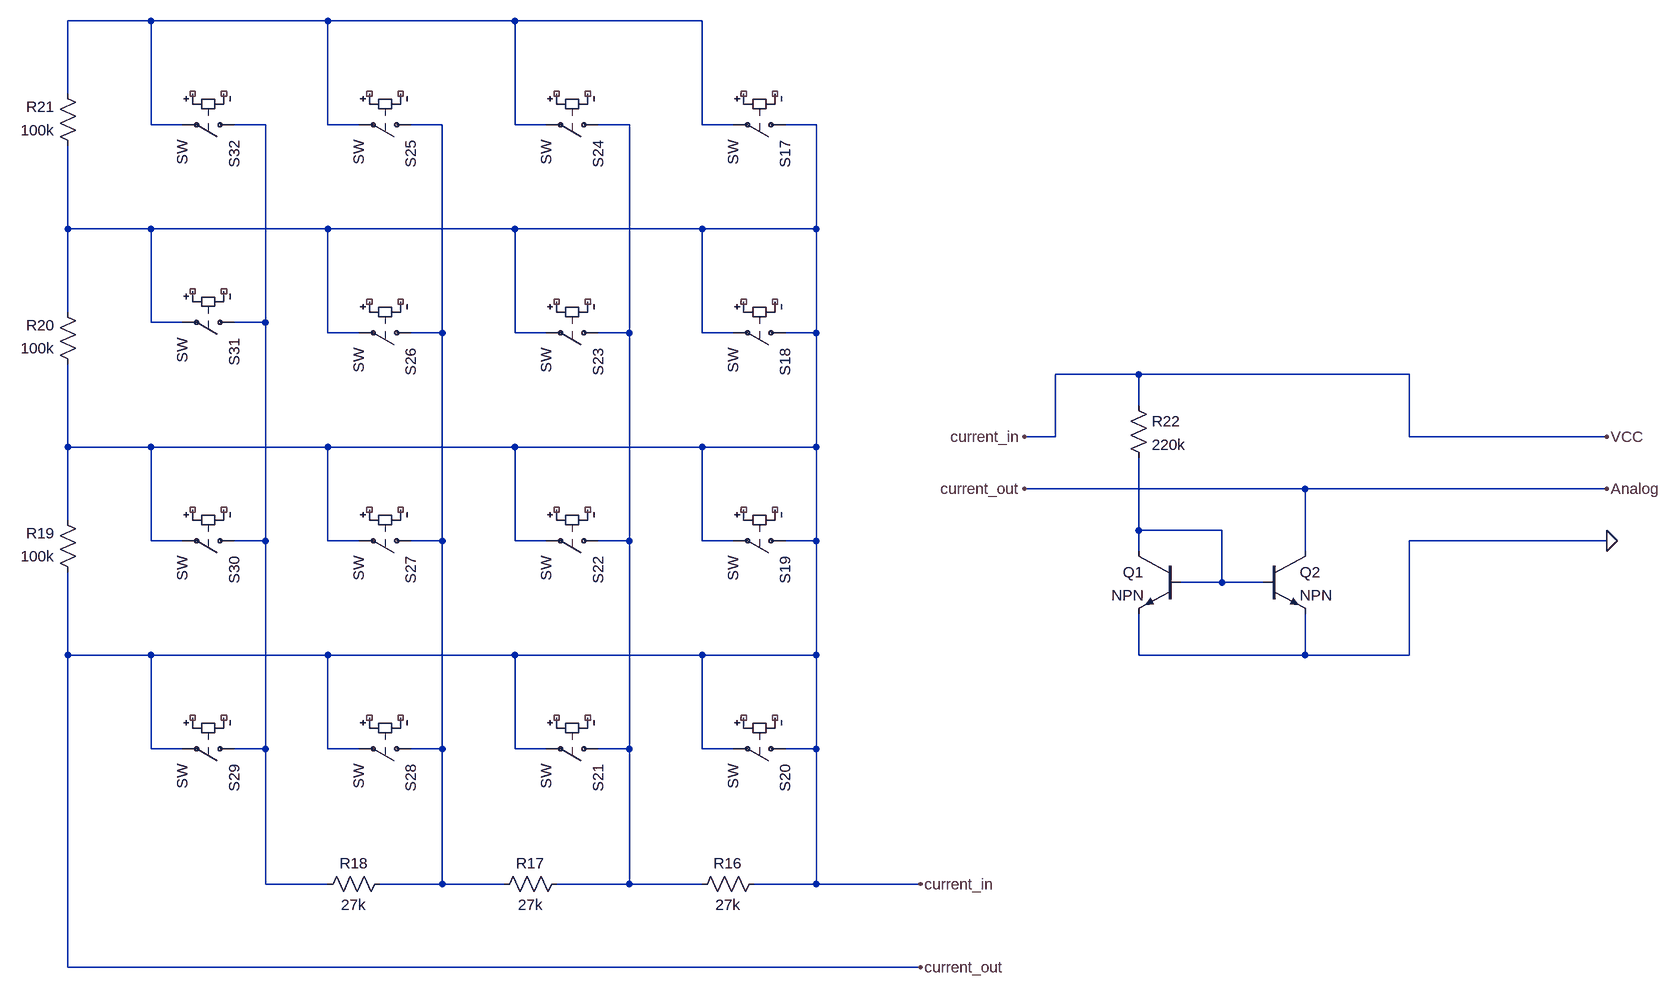
[diagram p0: schematic keypad_io.asc]
keypad_io.asc, the LTspice schematic file:
Version 4
SHEET 1 3556 1060
WIRE 944 -464 816 -464
WIRE 1216 -464 944 -464
WIRE 1504 -464 1216 -464
WIRE 1792 -464 1504 -464
WIRE 816 -352 816 -464
WIRE 944 -304 944 -464
WIRE 992 -304 944 -304
WIRE 1120 -304 1072 -304
WIRE 1216 -304 1216 -464
WIRE 1264 -304 1216 -304
WIRE 1392 -304 1344 -304
WIRE 1504 -304 1504 -464
WIRE 1552 -304 1504 -304
WIRE 1680 -304 1632 -304
WIRE 1792 -304 1792 -464
WIRE 1840 -304 1792 -304
WIRE 1968 -304 1920 -304
WIRE 816 -144 816 -272
WIRE 944 -144 816 -144
WIRE 1216 -144 944 -144
WIRE 1504 -144 1216 -144
WIRE 1792 -144 1504 -144
WIRE 1968 -144 1968 -304
WIRE 1968 -144 1792 -144
WIRE 816 -16 816 -144
WIRE 944 0 944 -144
WIRE 992 0 944 0
WIRE 1120 0 1120 -304
WIRE 1120 0 1072 0
WIRE 1216 16 1216 -144
WIRE 1264 16 1216 16
WIRE 1392 16 1392 -304
WIRE 1392 16 1344 16
WIRE 1504 16 1504 -144
WIRE 1552 16 1504 16
WIRE 1680 16 1680 -304
WIRE 1680 16 1632 16
WIRE 1792 16 1792 -144
WIRE 1840 16 1792 16
WIRE 1968 16 1968 -144
WIRE 1968 16 1920 16
WIRE 2464 80 2336 80
WIRE 2880 80 2464 80
WIRE 2464 128 2464 80
WIRE 2336 176 2336 80
WIRE 2336 176 2288 176
WIRE 2880 176 2880 80
WIRE 3184 176 2880 176
WIRE 816 192 816 64
WIRE 944 192 816 192
WIRE 1216 192 944 192
WIRE 1504 192 1216 192
WIRE 1792 192 1504 192
WIRE 1968 192 1968 16
WIRE 1968 192 1792 192
WIRE 2720 256 2288 256
WIRE 3184 256 2720 256
WIRE 816 304 816 192
WIRE 2464 320 2464 208
WIRE 2592 320 2464 320
WIRE 944 336 944 192
WIRE 992 336 944 336
WIRE 1120 336 1120 0
WIRE 1120 336 1072 336
WIRE 1216 336 1216 192
WIRE 1264 336 1216 336
WIRE 1392 336 1392 16
WIRE 1392 336 1344 336
WIRE 1504 336 1504 192
WIRE 1552 336 1504 336
WIRE 1680 336 1680 16
WIRE 1680 336 1632 336
WIRE 1792 336 1792 192
WIRE 1840 336 1792 336
WIRE 1968 336 1968 192
WIRE 1968 336 1920 336
WIRE 3184 336 2880 336
WIRE 2464 352 2464 320
WIRE 2720 352 2720 256
WIRE 2592 400 2592 320
WIRE 2592 400 2528 400
WIRE 2656 400 2592 400
WIRE 816 512 816 384
WIRE 944 512 816 512
WIRE 1216 512 944 512
WIRE 1504 512 1216 512
WIRE 1792 512 1504 512
WIRE 1968 512 1968 336
WIRE 1968 512 1792 512
WIRE 2464 512 2464 448
WIRE 2720 512 2720 448
WIRE 2720 512 2464 512
WIRE 2880 512 2880 336
WIRE 2880 512 2720 512
WIRE 944 656 944 512
WIRE 992 656 944 656
WIRE 1120 656 1120 336
WIRE 1120 656 1072 656
WIRE 1216 656 1216 512
WIRE 1264 656 1216 656
WIRE 1392 656 1392 336
WIRE 1392 656 1344 656
WIRE 1504 656 1504 512
WIRE 1552 656 1504 656
WIRE 1680 656 1680 336
WIRE 1680 656 1632 656
WIRE 1792 656 1792 512
WIRE 1840 656 1792 656
WIRE 1968 656 1968 512
WIRE 1968 656 1920 656
WIRE 1120 864 1120 656
WIRE 1216 864 1120 864
WIRE 1392 864 1392 656
WIRE 1392 864 1296 864
WIRE 1488 864 1392 864
WIRE 1680 864 1680 656
WIRE 1680 864 1568 864
WIRE 1792 864 1680 864
WIRE 1968 864 1968 656
WIRE 1968 864 1872 864
WIRE 2128 864 1968 864
WIRE 816 992 816 512
WIRE 2128 992 816 992
FLAG 3184 336 0
FLAG 2128 864 current_in
FLAG 2128 992 current_out
FLAG 2288 256 current_out
FLAG 3184 176 VCC
FLAG 3184 256 Analog
FLAG 2288 176 current_in
SYMBOL sw 1936 -304 R90
SYMATTR InstName S17
SYMBOL sw 1936 16 R90
SYMATTR InstName S18
SYMBOL sw 1936 336 R90
SYMATTR InstName S19
SYMBOL sw 1936 656 R90
SYMATTR InstName S20
SYMBOL sw 1648 656 R90
SYMATTR InstName S21
SYMBOL sw 1648 336 R90
SYMATTR InstName S22
SYMBOL sw 1648 16 R90
SYMATTR InstName S23
SYMBOL sw 1648 -304 R90
SYMATTR InstName S24
SYMBOL sw 1360 -304 R90
SYMATTR InstName S25
SYMBOL sw 1360 16 R90
SYMATTR InstName S26
SYMBOL sw 1360 336 R90
SYMATTR InstName S27
SYMBOL sw 1360 656 R90
SYMATTR InstName S28
SYMBOL sw 1088 656 R90
SYMATTR InstName S29
SYMBOL sw 1088 336 R90
SYMATTR InstName S30
SYMBOL sw 1088 0 R90
SYMATTR InstName S31
SYMBOL sw 1088 -304 R90
SYMATTR InstName S32
SYMBOL res 1888 848 R90
WINDOW 0 0 56 VBottom 2
WINDOW 3 32 56 VTop 2
SYMATTR InstName R16
SYMATTR Value 27k
SYMBOL res 1584 848 R90
WINDOW 0 0 56 VBottom 2
WINDOW 3 32 56 VTop 2
SYMATTR InstName R17
SYMATTR Value 27k
SYMBOL res 1312 848 R90
WINDOW 0 0 56 VBottom 2
WINDOW 3 32 56 VTop 2
SYMATTR InstName R18
SYMATTR Value 27k
SYMBOL res 832 400 R180
WINDOW 0 36 76 Left 2
WINDOW 3 36 40 Left 2
SYMATTR InstName R19
SYMATTR Value 100k
SYMBOL res 832 80 R180
WINDOW 0 36 76 Left 2
WINDOW 3 36 40 Left 2
SYMATTR InstName R20
SYMATTR Value 100k
SYMBOL res 832 -256 R180
WINDOW 0 36 76 Left 2
WINDOW 3 36 40 Left 2
SYMATTR InstName R21
SYMATTR Value 100k
SYMBOL res 2448 112 R0
SYMATTR InstName R22
SYMATTR Value 220k
SYMBOL npn 2528 352 M0
SYMATTR InstName Q1
SYMBOL npn 2656 352 R0
SYMATTR InstName Q2

The netlist it stands for:
* keypad_io.asc
S17 Analog N001 NC_01 NC_02 SW
S18 Analog Analog NC_03 NC_04 SW
S19 Analog Analog NC_05 NC_06 SW
S20 Analog Analog NC_07 NC_08 SW
S21 N004 Analog NC_09 NC_10 SW
S22 N004 Analog NC_11 NC_12 SW
S23 N004 Analog NC_13 NC_14 SW
S24 N004 N001 NC_15 NC_16 SW
S25 N003 N001 NC_17 NC_18 SW
S26 N003 Analog NC_19 NC_20 SW
S27 N003 Analog NC_21 NC_22 SW
S28 N003 Analog NC_23 NC_24 SW
S29 N002 Analog NC_25 NC_26 SW
S30 N002 Analog NC_27 NC_28 SW
S31 N002 Analog NC_29 NC_30 SW
S32 N002 N001 NC_31 NC_32 SW
R16 Analog N004 27k
R17 N004 N003 27k
R18 N003 N002 27k
R19 Analog Analog 100k
R20 Analog Analog 100k
R21 Analog N001 100k
R22 Analog N005 220k
Q1 N005 N005 0 0 NPN
Q2 Analog N005 0 0 NPN
.model NPN NPN
.model PNP PNP
.lib standard.bjt
.backanno
.end